# Altium schematic sheet USER_IO.SchDoc
size A3
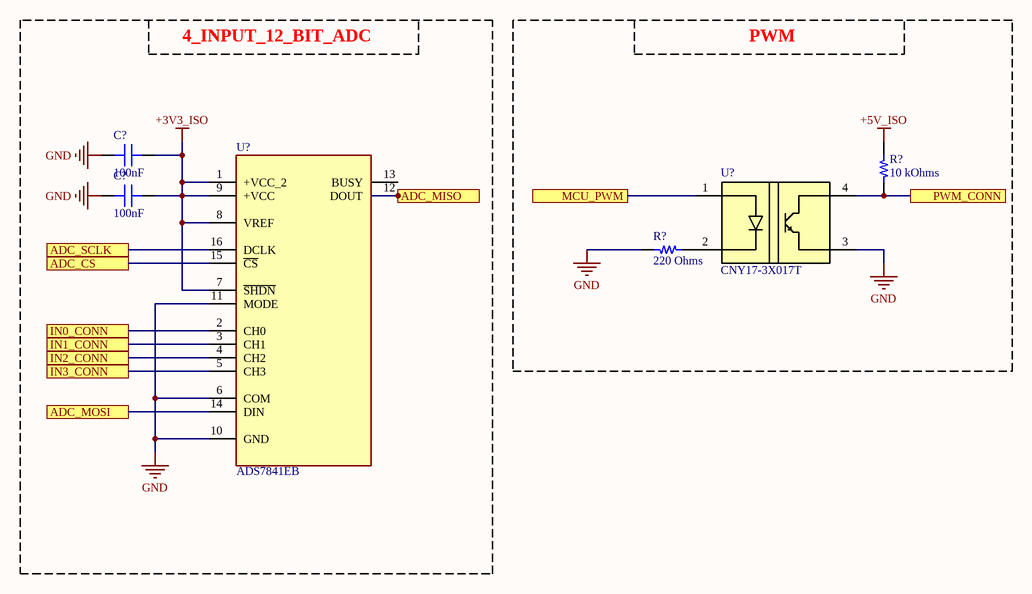
[diagram p0: USER_IO.SchDoc]

## Parts
(Parts that share a designator on the sheet are numbered #1, #2 ... from top to bottom, then left to right.)
C?#1  100nF  [CAP-0603]
C?#2  100nF  [CAP-0603]
R?#1  10 kOhms  [RES 0603_1608]
R?#2  220 Ohms  [RES 0603_1608]
U?#1  ADS7841EB  [SOP63P600X175-16N]
U?#2  CNY17-3X017T  [U0032]

## Blocks framed on the sheet
4_INPUT_12_BIT_ADC: C?#1 C?#2 U?#1
PWM: R?#1 R?#2 U?#2

## Ports
ADC_CS, ADC_MISO, ADC_MOSI, ADC_SCLK, IN0_CONN, IN1_CONN, IN2_CONN, IN3_CONN, MCU_PWM, PWM_CONN

## Nets
+3V3_ISO: C?#1.1 C?#2.1 U?#1.1(+VCC_2) U?#1.7(~{SHDN}) U?#1.8(VREF) U?#1.9(+VCC)
+5V_ISO: R?#1.2
GND: C?#1.2 C?#2.2 R?#2.2 U?#1.6(COM) U?#1.10(GND) U?#1.11(MODE) U?#2.3(E)
ADC_CS: U?#1.15(~{CS}) ; port ADC_CS
ADC_MISO: U?#1.12(DOUT) ; port ADC_MISO
ADC_MOSI: U?#1.14(DIN) ; port ADC_MOSI
ADC_SCLK: U?#1.16(DCLK) ; port ADC_SCLK
IN0_CONN: U?#1.2(CH0) ; port IN0_CONN
IN1_CONN: U?#1.3(CH1) ; port IN1_CONN
IN2_CONN: U?#1.4(CH2) ; port IN2_CONN
IN3_CONN: U?#1.5(CH3) ; port IN3_CONN
MCU_PWM: U?#2.1(A) ; port MCU_PWM
PWM_CONN: R?#1.1 U?#2.4(C) ; port PWM_CONN
NetR?#2_1: R?#2.1 U?#2.2(C)

Not connected (* = marked no-connect by the designer): U?#1 13(BUSY)

## Library data of the parts
C?#1 C?#2 = C0603C104K5RAC7411: Cap Ceramic 0.1uF 50V X7R 10% SMD 0603 125°C Paper T/R 100nF; Manufacturer: KEMET; Dissipation Factor: 2.5%; Supplier 1: Digi-Key; Manufacturer Part Number: C0603C104K5RAC7411; RoHS: Yes; Category: Ceramic Capacitors; Stock 1: 3300000; Pricing 1: 15000=0,01540, 30000=0,01463, 75000=0,01309, 105000=0,01059, 150000=0,01024, 375000=0,00963 (USD); Mount: Surface Mount; Case/Package: 0603; Case Code (Metric): 1608; Case Code (Imperial): 0603; Dielectric Material: Ceramic; Min Operating Temperature: -55°C; Max Operating Temperature: 125°C; Tolerance: 10%; Capacitance: 100nF; Dielectric: X7R; Voltage Rating (DC): 50V; Packaging: Tape and Reel; Package Quantity: 15000; Voltage Rating: 50V; Termination: SMD/SMT; Length: 1.6mm; Width: 0.031inch; Height: 0.8mm; Thickness: 0.035inch; Lead Pitch: 0.7mm; Depth: 0.8mm; Radiation Hardening: No; ComponentLink1URL: https://datasheet.ciiva.com/5424/kem-c1002-x7r-smd-5424426.pdf?src-supplier=Mouser; ComponentLink1Description: https://datasheet.ciiva.com/5424/kem-c1002-x7r-smd-5424426.pdf?src-supplier=Mouser; Supplier Part Number 1: 399-7374-2-ND
R?#1 = CRT0603-BY-1002EST: RESTHINFILM 0603 10K0 0.1% 100MW; Manufacturer: Bourns Inc.; Power (Watts): 0.1W, 1/10W; Temperature Coefficient: ±25ppm/°C; Part Number: CRT0603-BY-1002EST; Value: 10 kOhms; ComponentLink1Description: Datasheet; ComponentLink1URL: https://www.bourns.com/docs/Product-Datasheets/CRT-ST.pdf; ComponentLink2Description: DigiKey Link; ComponentLink2URL: http://digikey.com/product-detail/en/bourns-inc/CRT0603-BY-1002EST/CRT0603-BY-1002ESTCT-ND/7928091; Composition: Thin Film; Device Package: 0603 (1608 Metric); Features: Current Sense; Height - Seated (Max): 0.022" (0.55mm); LastUpdated: 20.05.2022 15:00:33; Lifecycle Status: Active; Minimum Order: 1; Number of Terminations: 2; Operating Temperature: -55°C ~ 155°C; Package / Case: 0603 (1608 Metric); Packaging: TapeAndReel; PartId: 23596; Part Status: Active; Price: 0.04; Resistance: 10 kOhms; Series: CRT-ST; Size / Dimension: 0.063" L x 0.031" W (1.60mm x 0.80mm); Supplier 1: DigiKey; Supplier Part Number 1: CRT0603-BY-1002ESTCT-ND; Supplier Device Package: 0603; Tolerance: ±0.1%
R?#2 = ERJ-3GEYJ221V: RES SMD 220 OHM 5% 1/10W 0603; Manufacturer: Panasonic Electronic Components; Power (Watts): 0.1W, 1/10W; Temperature Coefficient: ±200ppm/°C; Part Number: ERJ-3GEYJ221V; Value: 220 Ohms; ComponentLink1Description: Datasheet; ComponentLink1URL: http://industrial.panasonic.com/www-cgi/jvcr13pz.cgi?E+PZ+3+AOA0001+ERJ3GEYJ221V+7+WW; ComponentLink2Description: DigiKey Link; ComponentLink2URL: https://www.digikey.com/en/products/detail/panasonic-electronic-components/ERJ-3GEYJ221V/135719; Composition: Thick Film; Device Package: 0603 (1608 Metric); Features: Automotive AEC-Q200; Height - Seated (Max): 0.022" (0.55mm); LastUpdated: 20.05.2022 15:01:11; Lifecycle Status: Active; Minimum Order: 1; Number of Terminations: 2; Operating Temperature: -55°C ~ 155°C; Package / Case: 0603 (1608 Metric); Packaging: TapeAndReel; PartId: 12951; Part Status: Active; Price: 0.01; Ratings: AEC-Q200; Resistance: 220 Ohms; Series: ERJ-3G; Size / Dimension: 0.063" L x 0.031" W (1.60mm x 0.80mm); Supplier 1: DigiKey; Supplier Part Number 1: P220GCT-ND; Supplier Device Package: 0603; Tolerance: ±5%
U?#1 = ADS7841EB: Analogue to Digital Converter, 12 bit, 200 kSPS, Single, 2.7 V, 5.25 V, SSOP; MF: Texas Instruments; MP: ADS7841EB; SnapEDA_Link: https://www.snapeda.com/parts/ADS7841EB/Texas%20Instruments/view-part/559819/?ref=snap; Digi-Key_Purchase_URL: https://www.digikey.com/product-detail/en/texas-instruments/ADS7841EB-2K5/ADS7841EB-2K5-ND/300662?utm_source=snapeda&utm_medium=aggregator&utm_campaign=symbol; Value: *; Package: SSOP-16 Texas Instruments; Digi-Key_Part_Number: ADS7841EB/2K5-ND
U?#2 = U0032: Optoisolator Transistor with Base Output 5000Vrms 1 Channel 6-SMD; Manufacturer.: SHARP/Socle Technology; Part Number: PC81710NIP1B